# Altium schematic sheet MR_Motor_Control.SchDoc
size A4; CompanyName: BeeIonic; SheetNumber: 3; SheetTotal: 7
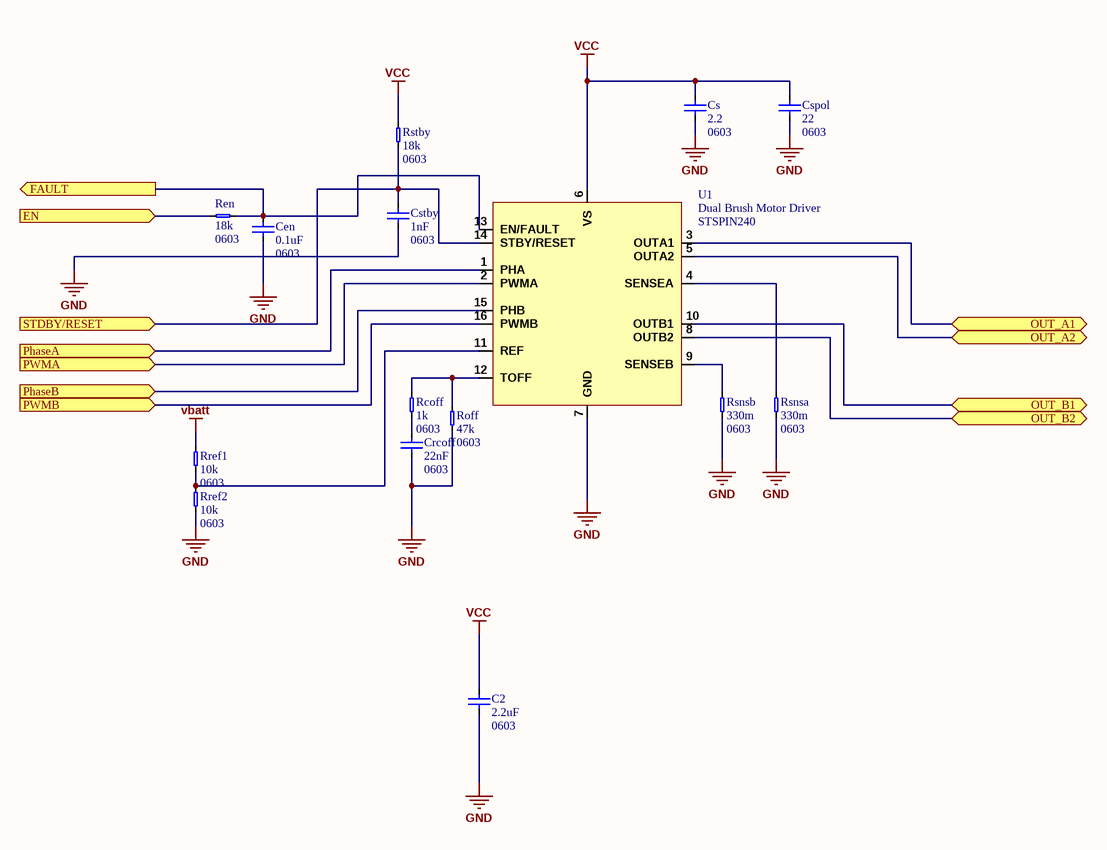
[diagram p0: MR_Motor_Control.SchDoc]

## Parts
C2  value 2.2uF  Package: 0603  [0603_CAP_LD]  (hidden comment: CerCap)
Cen  value 0.1uF  Package: 0603  [0603_CAP_LD]  (hidden comment: CerCap)
Crcoff  value 22nF  Package: 0603  [0603_CAP_LD]  (hidden comment: CerCap)
Cs  value 2.2  Package: 0603  [0603_CAP_LD]  (hidden comment: CerCap)
Cspol  value 22  Package: 0603  [0603_CAP_LD]  (hidden comment: CerCap)
Cstby  value 1nF  Package: 0603  [0603_CAP_LD]  (hidden comment: CerCap)
Rcoff  value 1k  Package: 0603  [0603_RES_LD]  (hidden comment: Resistor)
Ren  value 18k  Package: 0603  [0603_RES_LD]  (hidden comment: Resistor)
Roff  value 47k  Package: 0603  [0603_RES_LD]  (hidden comment: Resistor)
Rref1  value 10k  Package: 0603  [0603_RES_LD]  (hidden comment: Resistor)
Rref2  value 10k  Package: 0603  [0603_RES_LD]  (hidden comment: Resistor)
Rsnsa  value 330m  Package: 0603  [0603_RES_LD]  (hidden comment: Resistor)
Rsnsb  value 330m  Package: 0603  [0603_RES_LD]  (hidden comment: Resistor)
Rstby  value 18k  Package: 0603  [0603_RES_LD]  (hidden comment: Resistor)
U1  Dual Brush Motor Driver  [QFN-STSPIN240]

## Ports
EN (in), FAULT (out), OUT_A1 (bidir), OUT_A2 (bidir), OUT_B1 (bidir), OUT_B2 (bidir), PhaseA (in), PhaseB (in), PWMA (in), PWMB (in), STDBY/RESET (in)

## Nets
GND: C2.1 Cen.1 Crcoff.1 Cs.1 Cspol.1 Cstby.1 Roff.1 Rref2.1 Rsnsa.1 Rsnsb.1 U1.7(GND)
vbatt: Rref1.2
VCC: C2.2 Cs.2 Cspol.2 Rstby.2 U1.6(VS)
EN: Ren.1 ; port EN
FAULT: Cen.2 Ren.2 U1.13(EN/FAULT) ; port FAULT
OUT_A1: U1.3(OUTA1) ; port OUT_A1
OUT_A2: U1.5(OUTA2) ; port OUT_A2
OUT_B1: U1.10(OUTB1) ; port OUT_B1
OUT_B2: U1.8(OUTB2) ; port OUT_B2
PhaseA: U1.1(PHA) ; port PhaseA
PhaseB: U1.15(PHB) ; port PhaseB
PWMA: U1.2(PWMA) ; port PWMA
PWMB: U1.16(PWMB) ; port PWMB
STDBY/RESET: Cstby.2 Rstby.1 U1.14(STBY/RESET) ; port STDBY/RESET
NetCrcoff_2: Crcoff.2 Rcoff.1
NetRcoff_2: Rcoff.2 Roff.2 U1.12(TOFF)
NetRref1_1: Rref1.1 Rref2.2 U1.11(REF)
NetRsnsa_2: Rsnsa.2 U1.4(SENSEA)
NetRsnsb_2: Rsnsb.2 U1.9(SENSEB)

## Notes on the sheet
- Project :
- Title :
- Sheet:
- of
- Creation Date :
- Designer :
- Modified Date :

## Library data of the parts
C2 Cen Crcoff Cs Cspol Cstby = CerCap: Ceramic Capacitor; Type: *; Voltage/Power: *
U1 = STSPIN240: ST Dual Motor Driver; Reference: STSPIN240
Rcoff Ren Roff Rref1 Rref2 Rsnsa Rsnsb Rstby = Resistor: Precision: *